# Altium schematic sheet 08.SchDoc
size 513 x 386 mm
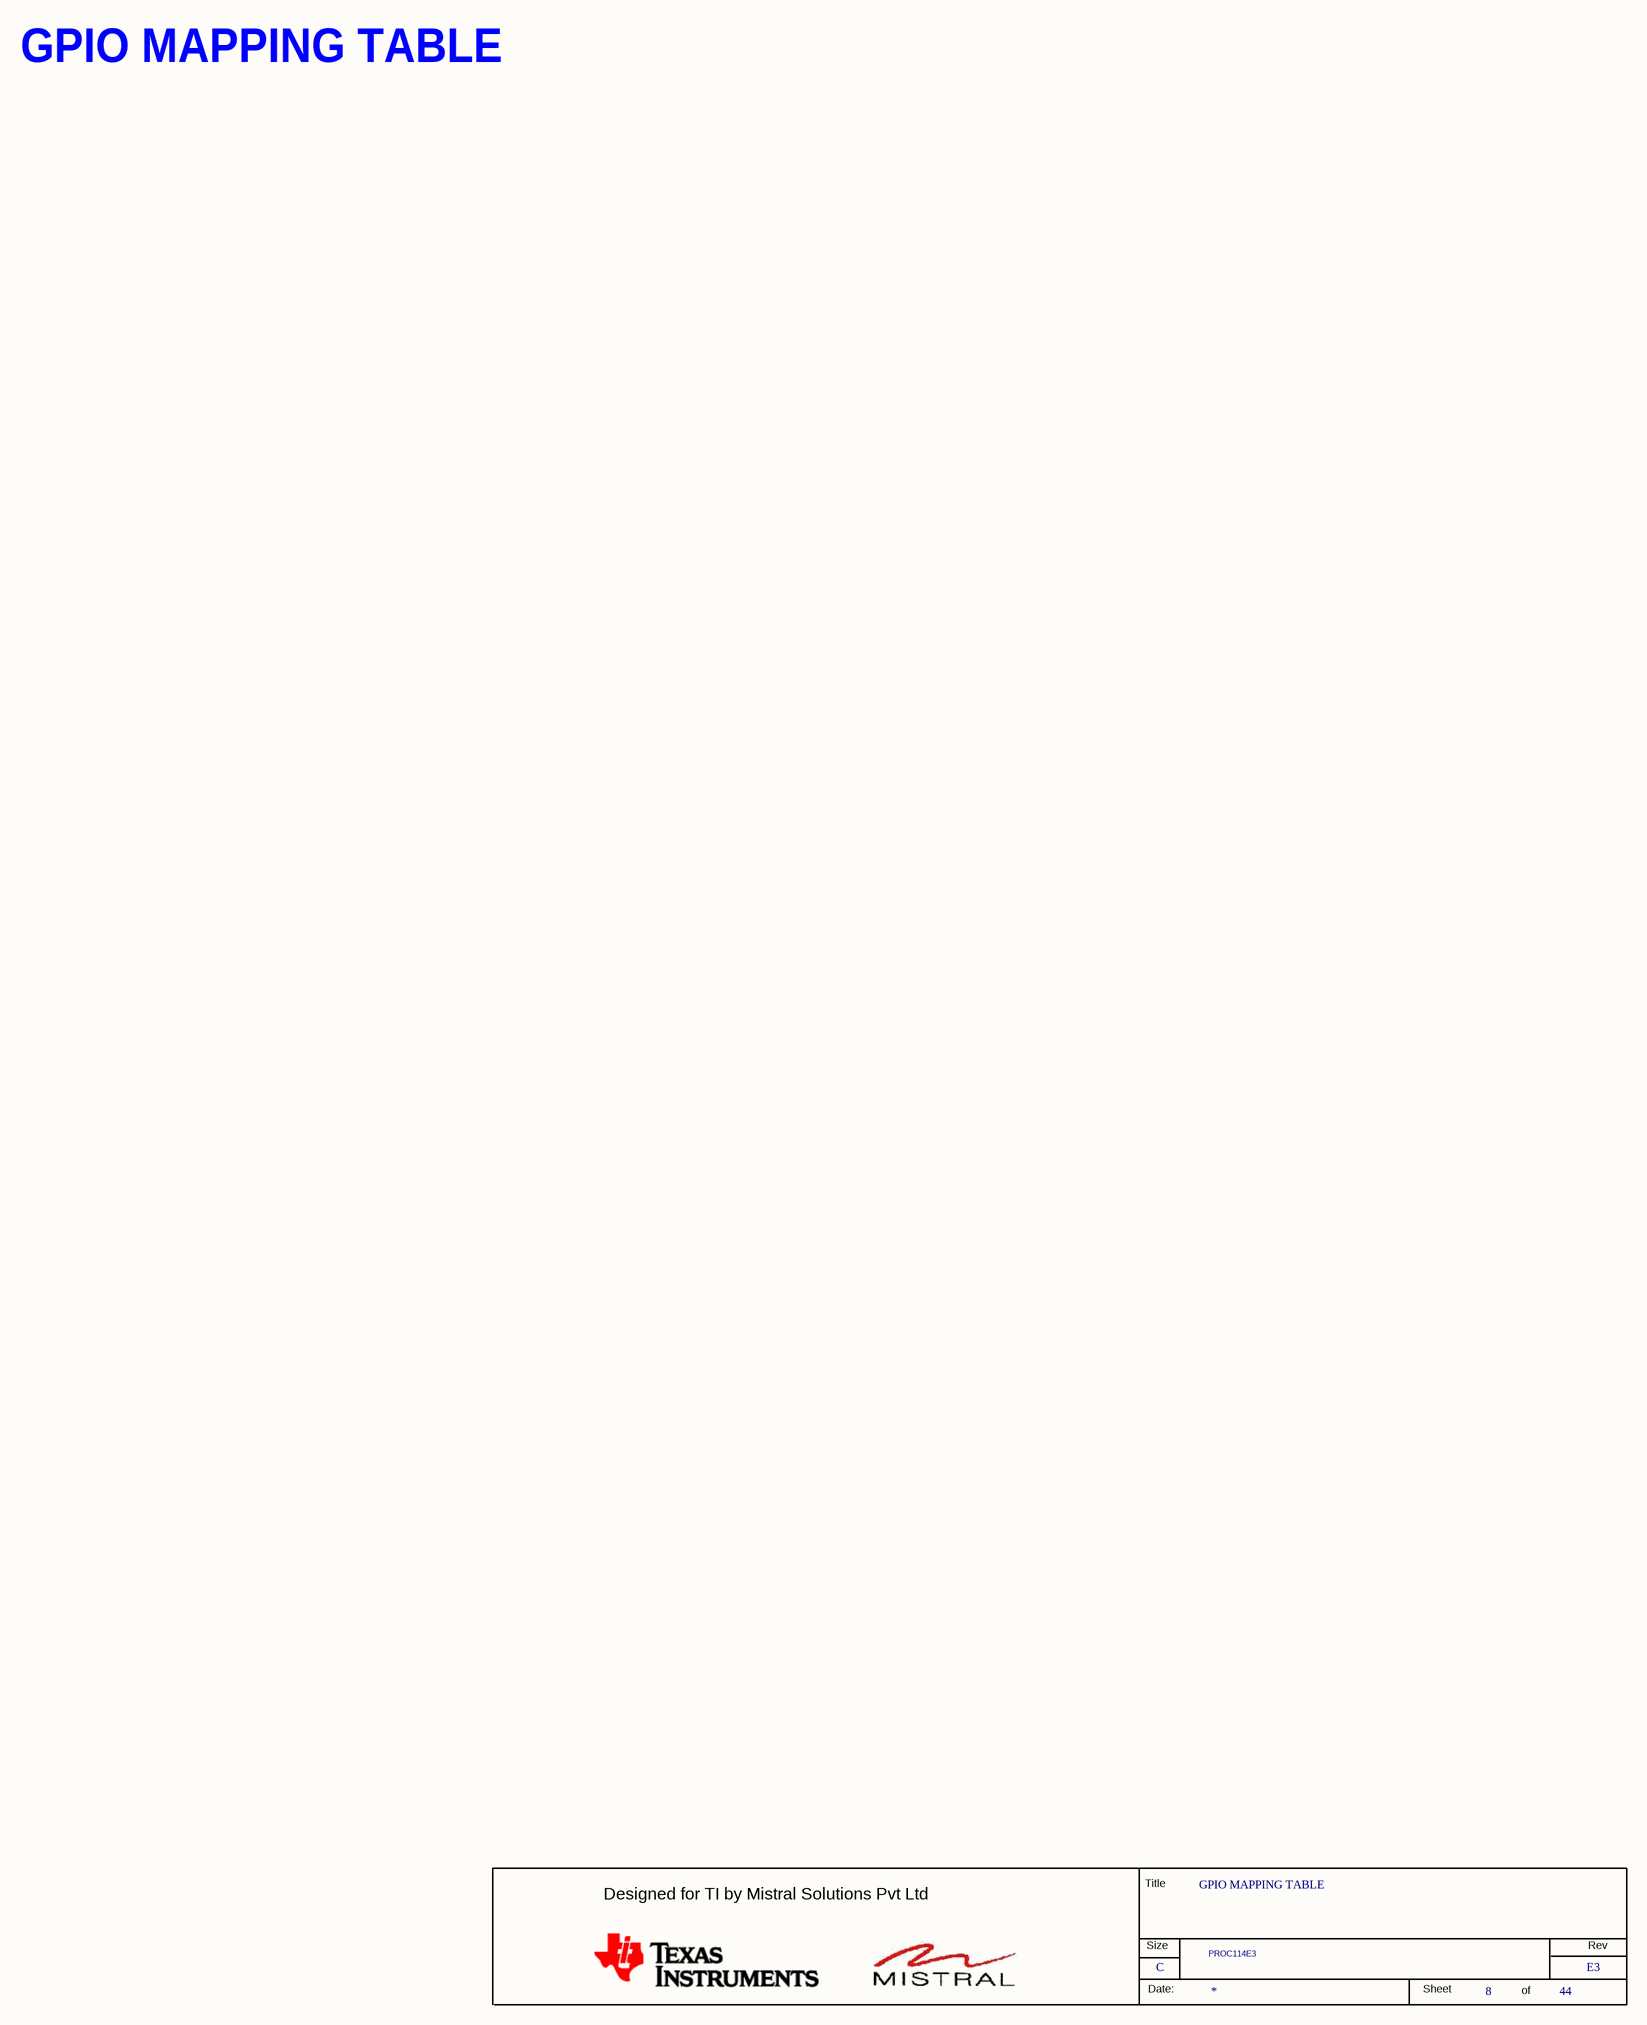
[diagram p0: 08.SchDoc]

## Parts
*  RevCode: E3  Title: GPIO MAPPING TABLE  Page Size: C  Page Number: 8  Page Count: 44  Variant Name: PROC114E3  (hidden comment: MISTRAL_TITLEBLK_CSIZE)  (graphical)

## Notes on the sheet
- GPIO MAPPING TABLE
- (in symbol MISTRAL_TITLEBLK_CSIZE) Title; Designed for TI by Mistral Solutions Pvt Ltd; Size; Rev; Date:; Sheet; of

## Library data of the parts
* = MISTRAL_TITLEBLK_CSIZE: Issue: 1.0; Page Create Date: March  8, 1995; Page Modify Date: *; Schematic Page Count: 44; Schematic Page Number: 8